# Altium schematic sheet config-bank3.SchDoc: Config FPGA - Bank 3
size Letter; CompanyName: Brinton Engineering, LLC; Address1: 3479 Edison Way; Address2: Menlo Park CA 94025; Address3: +1 (877) 778-8435; Address4: brintonengineering.com; Revision: 1; SheetNumber: 1; SheetTotal: 1
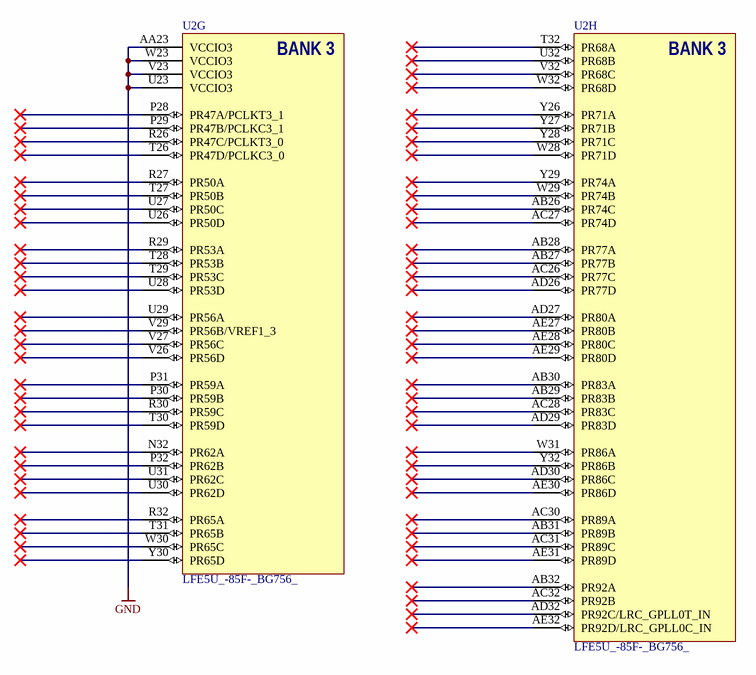
[diagram p0: config-bank3.SchDoc]

## Parts
U2  LFE5U_-85F-_BG756_  [caBGA756]  (parts G,H of 19)

## Nets
GND: U2.AA23(VCCIO3) U2.U23(VCCIO3) U2.V23(VCCIO3) U2.W23(VCCIO3)

Not connected (* = marked no-connect by the designer): U2 AB26(PR74C)* AB27(PR77B)* AB28(PR77A)* AB29(PR83B)* AB30(PR83A)* AB31(PR89B)* AB32(PR92A)* AC26(PR77C)* AC27(PR74D)* AC28(PR83C)* AC30(PR89A)* AC31(PR89C)* AC32(PR92B)* AD26(PR77D)* AD27(PR80A)* AD29(PR83D)* AD30(PR86C)* AD32(PR92C/LRC_GPLL0T_IN)* AE27(PR80B)* AE28(PR80C)* AE29(PR80D)* AE30(PR86D)* AE31(PR89D)* AE32(PR92D/LRC_GPLL0C_IN)* N32(PR62A)* P28(PR47A/PCLKT3_1)* P29(PR47B/PCLKC3_1)* P30(PR59B)* P31(PR59A)* P32(PR62B)* R26(PR47C/PCLKT3_0)* R27(PR50A)* R29(PR53A)* R30(PR59C)* R32(PR65A)* T26(PR47D/PCLKC3_0)* T27(PR50B)* T28(PR53B)* T29(PR53C)* T30(PR59D)* T31(PR65B)* T32(PR68A)* U26(PR50D)* U27(PR50C)* U28(PR53D)* U29(PR56A)* U30(PR62D)* U31(PR62C)* U32(PR68B)* V26(PR56D)* V27(PR56C)* V29(PR56B/VREF1_3)* V32(PR68C)* W28(PR71D)* W29(PR74B)* W30(PR65C)* W31(PR86A)* W32(PR68D)* Y26(PR71A)* Y27(PR71B)* Y28(PR71C)* Y29(PR74A)* Y30(PR65D)* Y32(PR86B)*

## Notes on the sheet
- Title
- Engineer
- Revision
- Drawn By
- Checked By
- Date
- Sheet
- of
- (in symbol LFE5U_-85F-_BG756_, part G) BANK 3
- (in symbol LFE5U_-85F-_BG756_, part H) BANK 3

## Library data of the parts
U2 = LFE5U_-85F-_BG756_: ECP5 FPGA, 85k LUT, 756-caBGA; Manufacturer: Lattice Semiconductor; Manufacturer P/N: LFE5U_-85F-_BG756_